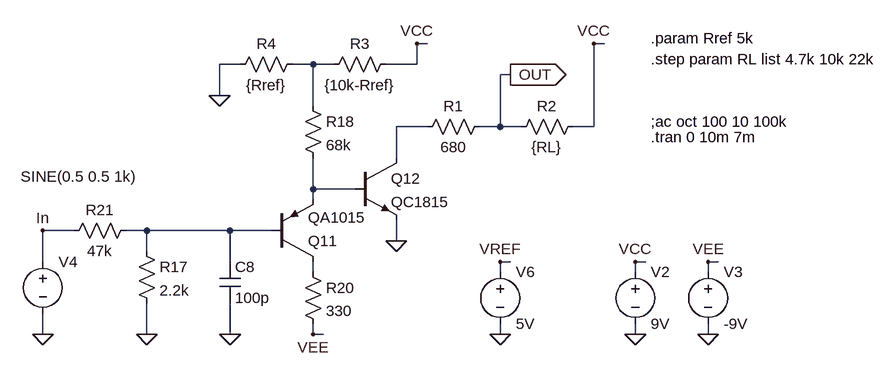
[diagram p0: schematic AntilogMM.asc]
AntilogMM.asc, the LTspice schematic file:
Version 4
SHEET 1 1572 1944
WIRE -544 816 -560 816
WIRE -272 816 -288 816
WIRE -832 848 -864 848
WIRE -720 848 -752 848
WIRE -688 848 -720 848
WIRE -560 848 -560 816
WIRE -560 848 -608 848
WIRE -416 864 -432 864
WIRE -864 896 -864 848
WIRE -720 912 -720 848
WIRE -544 944 -592 944
WIRE -432 944 -432 864
WIRE -432 944 -464 944
WIRE -400 944 -432 944
WIRE -288 944 -288 816
WIRE -288 944 -320 944
WIRE -592 992 -592 944
WIRE -720 1040 -720 992
WIRE -656 1040 -720 1040
WIRE -720 1056 -720 1040
WIRE -1088 1104 -1136 1104
WIRE -976 1104 -1008 1104
WIRE -848 1104 -976 1104
WIRE -784 1104 -848 1104
WIRE -592 1120 -592 1088
WIRE -976 1136 -976 1104
WIRE -1136 1152 -1136 1104
WIRE -848 1152 -848 1104
WIRE -416 1152 -432 1152
WIRE -208 1152 -224 1152
WIRE -96 1152 -112 1152
WIRE -720 1168 -720 1152
WIRE -432 1168 -432 1152
WIRE -224 1168 -224 1152
WIRE -112 1168 -112 1152
WIRE -1136 1264 -1136 1232
WIRE -976 1264 -976 1216
WIRE -848 1264 -848 1216
WIRE -720 1264 -720 1248
WIRE -704 1264 -720 1264
WIRE -432 1264 -432 1248
WIRE -224 1264 -224 1248
WIRE -112 1264 -112 1248
FLAG -224 1264 0
FLAG -224 1152 VCC
FLAG -112 1264 0
FLAG -112 1152 VEE
FLAG -1136 1264 0
FLAG -976 1264 0
FLAG -592 1120 0
FLAG -1136 1104 In
FLAG -432 1264 0
FLAG -432 1152 VREF
FLAG -720 1264 VEE
FLAG -848 1264 0
FLAG -288 816 VCC
FLAG -864 896 0
FLAG -560 816 VCC
FLAG -416 864 OUT
IOPIN -416 864 Out
SYMBOL voltage -224 1152 R0
WINDOW 123 0 0 Left 2
WINDOW 39 0 0 Left 2
SYMATTR InstName V2
SYMATTR Value 9V
SYMBOL voltage -112 1152 R0
WINDOW 123 0 0 Left 2
WINDOW 39 0 0 Left 2
SYMATTR InstName V3
SYMATTR Value -9V
SYMBOL voltage -1136 1136 R0
WINDOW 3 -34 -115 Left 2
WINDOW 123 0 0 Left 2
WINDOW 39 0 0 Left 2
SYMATTR Value SINE(0.5 0.5 1k)
SYMATTR InstName V4
SYMBOL pnp -784 1152 M180
SYMATTR InstName Q11
SYMATTR Value QA1015
SYMBOL res -992 1120 R0
SYMATTR InstName R17
SYMATTR Value 2.2k
SYMBOL res -736 896 R0
SYMATTR InstName R18
SYMATTR Value 68k
SYMBOL npn -656 992 R0
SYMATTR InstName Q12
SYMATTR Value QC1815
SYMBOL res -736 1152 R0
SYMATTR InstName R20
SYMATTR Value 330
SYMBOL res -992 1088 R90
WINDOW 0 0 56 VBottom 2
WINDOW 3 32 56 VTop 2
SYMATTR InstName R21
SYMATTR Value 47k
SYMBOL voltage -432 1152 R0
WINDOW 123 0 0 Left 2
WINDOW 39 0 0 Left 2
SYMATTR InstName V6
SYMATTR Value 5V
SYMBOL cap -864 1152 R0
SYMATTR InstName C8
SYMATTR Value 100p
SYMBOL res -448 928 R90
WINDOW 0 0 56 VBottom 2
WINDOW 3 32 56 VTop 2
SYMATTR InstName R1
SYMATTR Value 680
SYMBOL res -304 928 R90
WINDOW 0 0 56 VBottom 2
WINDOW 3 32 56 VTop 2
SYMATTR InstName R2
SYMATTR Value {RL}
SYMBOL res -592 832 R90
WINDOW 0 0 56 VBottom 2
WINDOW 3 32 56 VTop 2
SYMATTR InstName R3
SYMATTR Value {10k-Rref}
SYMBOL res -736 832 R90
WINDOW 0 0 56 VBottom 2
WINDOW 3 32 56 VTop 2
SYMATTR InstName R4
SYMATTR Value {Rref}
TEXT -200 936 Left 2 !;ac oct 100 10 100k
TEXT -200 960 Left 2 !.tran 0 10m 7m
TEXT -200 808 Left 2 !.param Rref 5k
TEXT -200 840 Left 2 !.step param RL list 4.7k 10k 22k

The netlist it stands for:
* AntilogMM.asc
V2 VCC 0 9V
V3 VEE 0 -9V
V4 In 0 SINE(0.5 0.5 1k)
Q11 N005 N004 N003 0 QA1015
R17 N004 0 2.2k
R18 N001 N003 68k
Q12 N002 N003 0 0 QC1815
R20 N005 VEE 330
R21 N004 In 47k
V6 VREF 0 5V
C8 N004 0 100p
R1 OUT N002 680
R2 VCC OUT {RL}
R3 VCC N001 {10k-Rref}
R4 N001 0 {Rref}
.model NPN NPN
.model PNP PNP
.lib standard.bjt
;ac oct 100 10 100k
.tran 0 10m 7m
.param Rref 5k
.step param RL list 4.7k 10k 22k
.backanno
.end